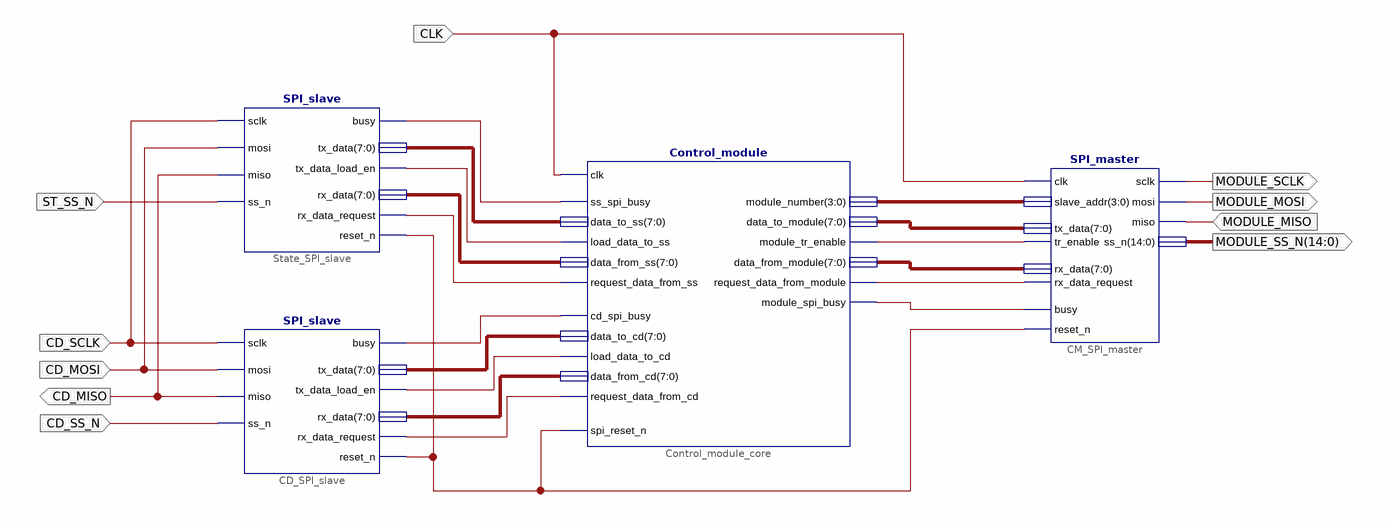
[diagram p0: schematic sheet 1]
// Xilinx ISE schematic Control_module_scheme.sch (spartan3e) as structural Verilog: 4 symbols, 10 ports
module Control_module_scheme (
  input  CD_MOSI,
  input  CD_SCLK,
  input  CD_SS_N,
  input  ST_SS_N,
  input  CLK,
  input  MODULE_MISO,
  output CD_MISO,
  output MODULE_SCLK,
  output MODULE_MOSI,
  output [14:0] MODULE_SS_N
);

  wire XLXN_76, XLXN_78, XLXN_80, XLXN_81, XLXN_83, XLXN_85, XLXN_92, XLXN_100, XLXN_101, XLXN_102;
  wire [3:0] XLXN_89;
  wire [7:0] XLXN_77, XLXN_79, XLXN_82, XLXN_84, XLXN_91, XLXN_93;

  Control_module Control_module_core (
    .cd_spi_busy(XLXN_81), .ss_spi_busy(XLXN_76), .clk(CLK), .data_from_cd(XLXN_84), .data_from_ss(XLXN_79),
    .data_from_module(XLXN_91), .request_data_from_cd(XLXN_85), .load_data_to_cd(XLXN_83),
    .request_data_from_ss(XLXN_80), .load_data_to_ss(XLXN_78), .module_tr_enable(XLXN_92),
    .spi_reset_n(XLXN_100), .data_to_cd(XLXN_82), .data_to_ss(XLXN_77), .module_number(XLXN_89),
    .data_to_module(XLXN_93), .request_data_from_module(XLXN_101), .module_spi_busy(XLXN_102));
  SPI_slave State_SPI_slave (
    .sclk(CD_SCLK), .mosi(CD_MOSI), .miso(CD_MISO), .ss_n(ST_SS_N), .busy(XLXN_76), .tx_data(XLXN_77),
    .tx_data_load_en(XLXN_78), .rx_data(XLXN_79), .rx_data_request(XLXN_80), .reset_n(XLXN_100));
  SPI_slave CD_SPI_slave (
    .sclk(CD_SCLK), .mosi(CD_MOSI), .miso(CD_MISO), .ss_n(CD_SS_N), .busy(XLXN_81), .tx_data(XLXN_82),
    .tx_data_load_en(XLXN_83), .rx_data(XLXN_84), .rx_data_request(XLXN_85), .reset_n(XLXN_100));
  SPI_master CM_SPI_master (
    .clk(CLK), .miso(MODULE_MISO), .tr_enable(XLXN_92), .tx_data(XLXN_93), .slave_addr(XLXN_89),
    .sclk(MODULE_SCLK), .mosi(MODULE_MOSI), .ss_n(MODULE_SS_N), .rx_data(XLXN_91),
    .rx_data_request(XLXN_101), .busy(XLXN_102), .reset_n(XLXN_100));
endmodule
